# Altium schematic sheet Sheet_1.SchDoc: R2C2 - RepRapCncController
size A3; CompanyName: bitBOX; DrawnBy: FMendes75@gmail.com; Revision: V1.2P; SheetNumber: 1; SheetTotal: 3; PageSetup: Record=PageOptions|CenterHorizontal=True|CenterVertical=True|PrintScale=1.04|XCorrection=1.00|YCorrection=1.00|PrintKind=1|BorderSize=5000000|LeftOffset=0|BottomOffset=0|Orientation=2|PaperLength=1000|PaperWidth=1000|Scale=100|PaperSource=7|PrintQuality=-4|MediaType=1|DitherType=10|PaperKind=A3|PrintScaleMode=1; license: Creative Commons BY-NC-SA; Site: www.3dprinting-r2c2.com; ProjectName: R2C2 - RepRapCncController
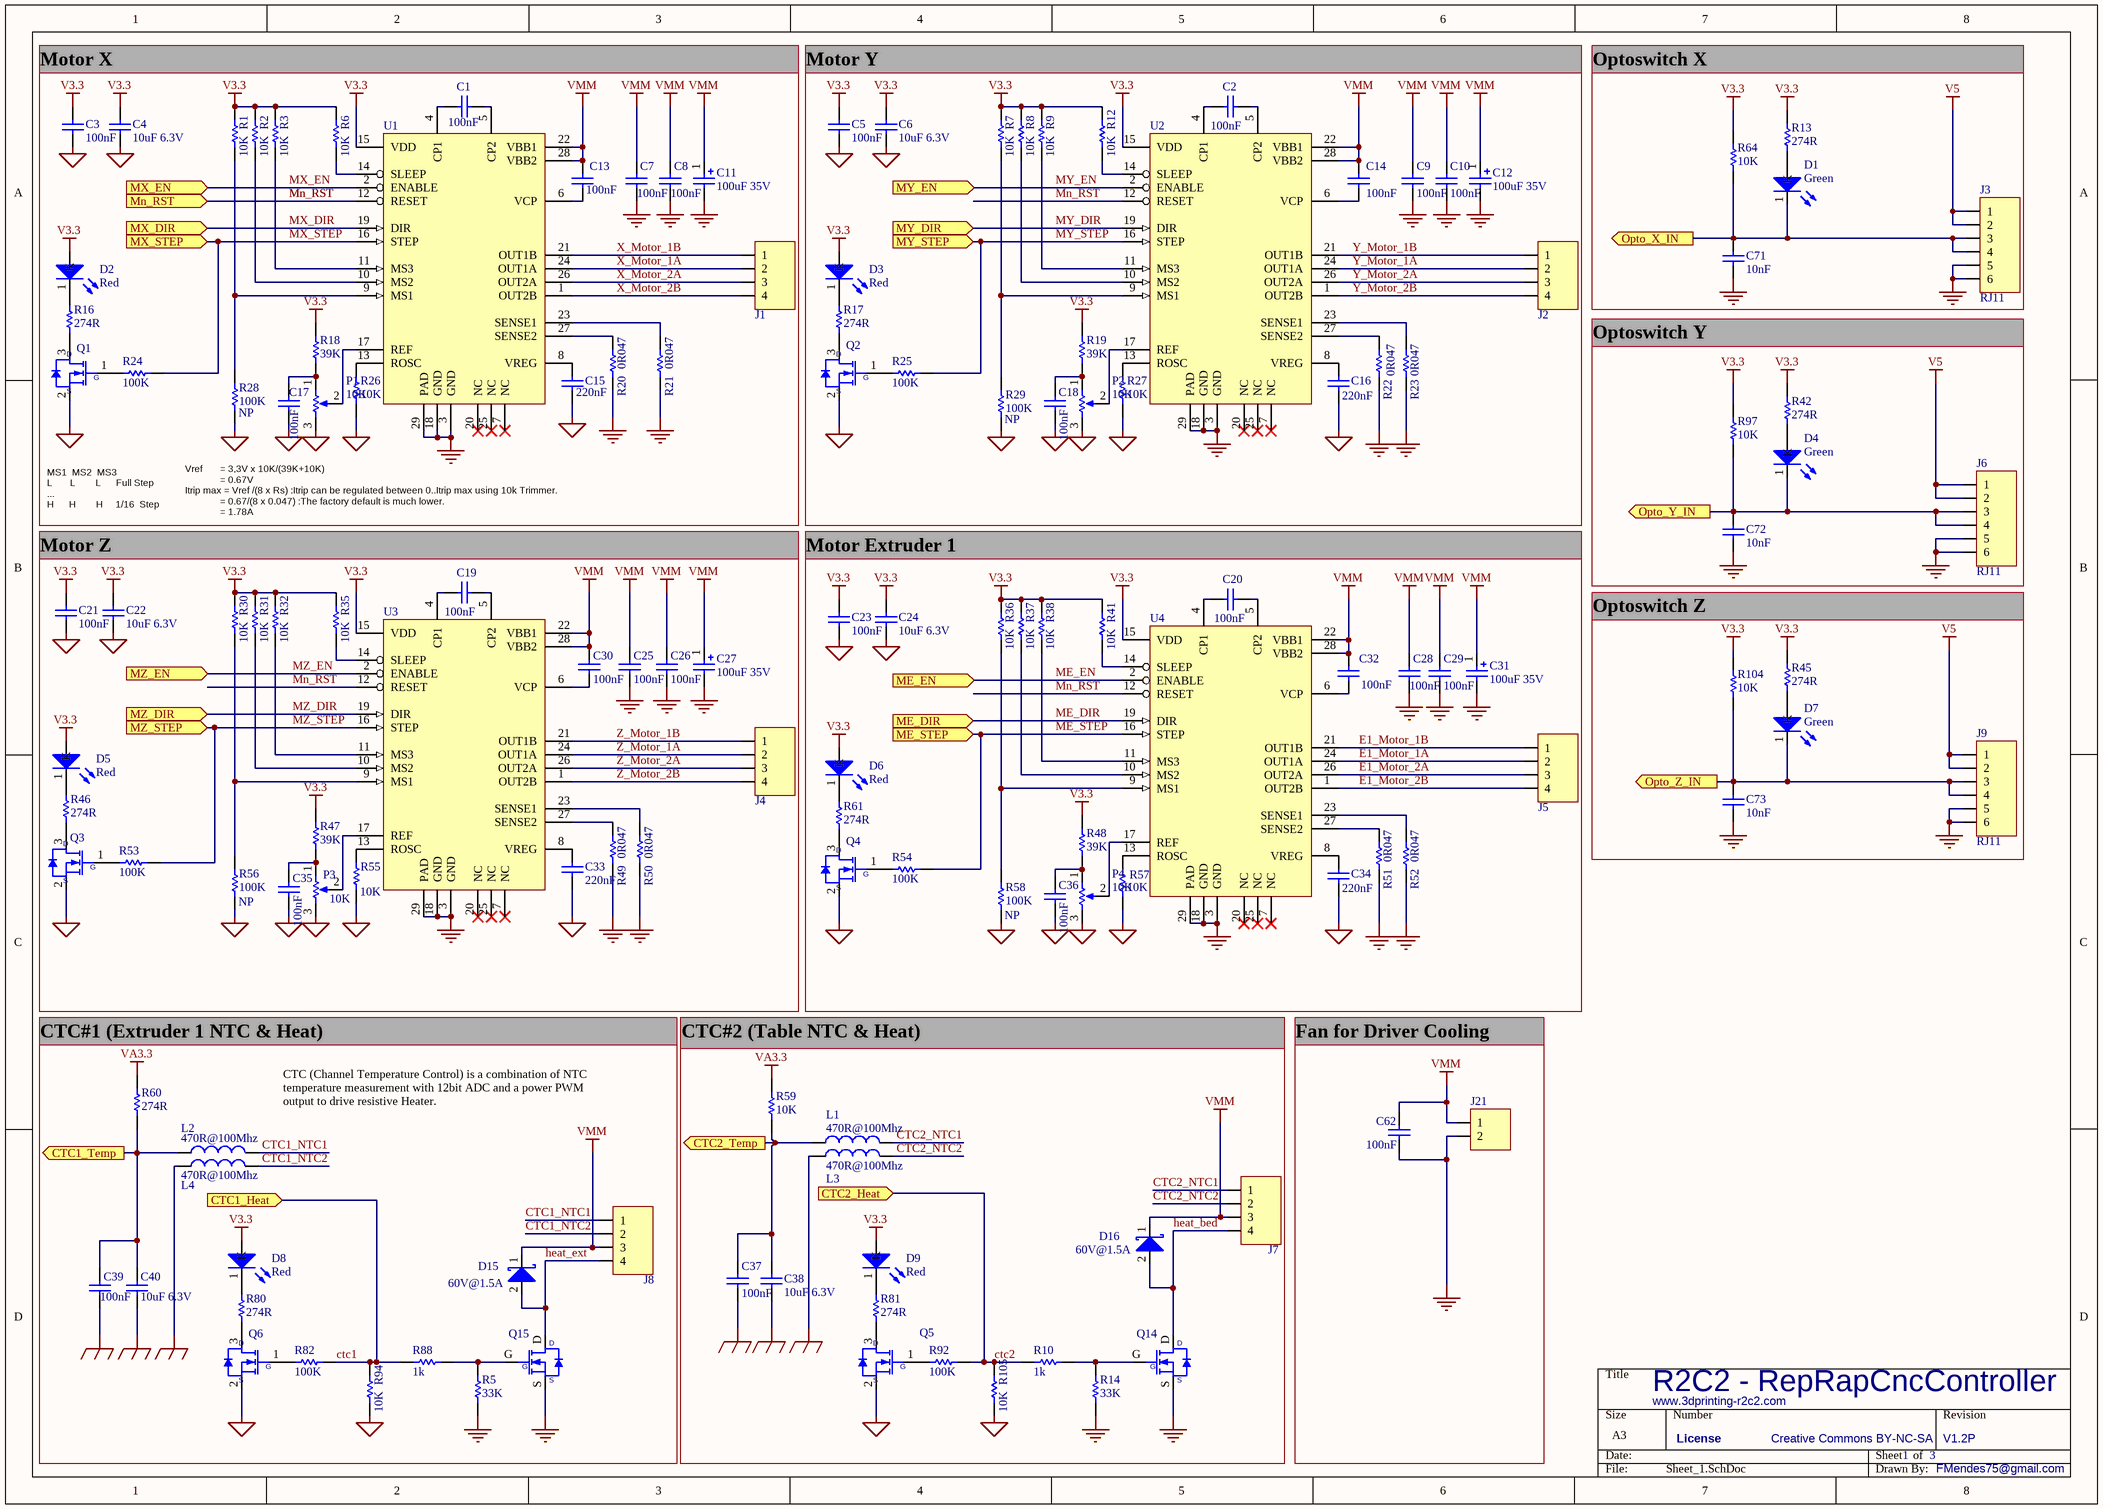
[diagram p0: Sheet_1.SchDoc]

## Parts
C1  100nF  [CAPC1608M]
C2  100nF  [CAPC1608M]
C3  100nF  [CAPC1608M]
C4  10uF 6.3V  [CAPC2012M]
C5  100nF  [CAPC1608M]
C6  10uF 6.3V  [CAPC2012M]
C7  100nF  [CAPC1608M]
C8  100nF  [CAPC1608M]
C9  100nF  [CAPC1608M]
C10  100nF  [CAPC1608M]
C11  100uF 35V  [CAPAE63x63MM]
C12  100uF 35V  [CAPAE63x63MM]
C13  100nF  [CAPC1608M]
C14  100nF  [CAPC1608M]
C15  220nF  [CAPC1608M]
C16  220nF  [CAPC1608M]
C17  100nF  [CAPC1608M]
C18  100nF  [CAPC1608M]
C19  100nF  [CAPC1608M]
C20  100nF  [CAPC1608M]
C21  100nF  [CAPC1608M]
C22  10uF 6.3V  [CAPC2012M]
C23  100nF  [CAPC1608M]
C24  10uF 6.3V  [CAPC2012M]
C25  100nF  [CAPC1608M]
C26  100nF  [CAPC1608M]
C27  100uF 35V  [CAPAE63x63MM]
C28  100nF  [CAPC1608M]
C29  100nF  [CAPC1608M]
C30  100nF  [CAPC1608M]
C31  100uF 35V  [CAPAE63x63MM]
C32  100nF  [CAPC1608M]
C33  220nF  [CAPC1608M]
C34  220nF  [CAPC1608M]
C35  100nF  [CAPC1608M]
C36  100nF  [CAPC1608M]
C37  100nF  [CAPC1608M]
C38  10uF 6.3V  [CAPC2012M]
C39  100nF  [CAPC1608M]
C40  10uF 6.3V  [CAPC2012M]
C62  100nF  [CAPC1608M]
C71  10nF  [CAPC1608M]
C72  10nF  [CAPC1608M]
C73  10nF  [CAPC1608M]
D1  Green  [LEDM_3216X12M]
D2  Red  [LEDM_3216X12M]
D3  Red  [LEDM_3216X12M]
D4  Green  [LEDM_3216X12M]
D5  Red  [LEDM_3216X12M]
D6  Red  [LEDM_3216X12M]
D7  Green  [LEDM_3216X12M]
D8  Red  [LEDM_3216X12M]
D9  Red  [LEDM_3216X12M]
D15  60V@1.5A  [SMA]
D16  60V@1.5A  [SMA]
J1  (no value)  [TE_SCREW_1X4]
J2  (no value)  [TE_SCREW_1X4]
J3  RJ11  [MOLEX_95022-2667]
J4  (no value)  [TE_SCREW_1X4]
J5  (no value)  [TE_SCREW_1X4]
J6  RJ11  [MOLEX_95022-2667]
J7  (no value)  [TE_SCREW_282841-4]
J8  (no value)  [TE_SCREW_282841-4]
J9  RJ11  [MOLEX_95022-2667]
J21  -  [MOLEX_22-29-2021]  (value not drawn)
L1  470R@100Mhz  [INDC1608M]
L2  470R@100Mhz  [INDC1608M]
L3  470R@100Mhz  [INDC1608M]
L4  470R@100Mhz  [INDC1608M]
P1  10K  [Trimmer_14]
P2  10K  [Trimmer_14]
P3  10K  [Trimmer_14]
P4  10K  [Trimmer_14]
Q1  (no value)  [SOT323-3AM]
Q2  (no value)  [SOT323-3AM]
Q3  (no value)  [SOT323-3AM]
Q4  (no value)  [SOT323-3AM]
Q5  (no value)  [SOT323-3AM]
Q6  (no value)  [SOT323-3AM]
Q14  (no value)  [SuperSOP8_csd17301]
Q15  (no value)  [SuperSOP8_csd17301]
R1  10K  [RESC1608M]
R2  10K  [RESC1608M]
R3  10K  [RESC1608M]
R5  33K  [RESC1608M]
R6  10K  [RESC1608M]
R7  10K  [RESC1608M]
R8  10K  [RESC1608M]
R9  10K  [RESC1608M]
R10  1k  [RESC1608M]
R12  10K  [RESC1608M]
R13  274R  [RESC1608M]
R14  33K  [RESC1608M]
R16  274R  [RESC1608M]
R17  274R  [RESC1608M]
R18  39K  [RESC1608M]
R19  39K  [RESC1608M]
R20  0R047  [RESC3216M]
R21  0R047  [RESC3216M]
R22  0R047  [RESC3216M]
R23  0R047  [RESC3216M]
R24  100K  [RESC1608M]
R25  100K  [RESC1608M]
R26  10K  [RESC1608M]
R27  10K  [RESC1608M]
R28  100K  Populate: NP  [RESC1608M]
R29  100K  Populate: NP  [RESC1608M]
R30  10K  [RESC1608M]
R31  10K  [RESC1608M]
R32  10K  [RESC1608M]
R35  10K  [RESC1608M]
R36  10K  [RESC1608M]
R37  10K  [RESC1608M]
R38  10K  [RESC1608M]
R41  10K  [RESC1608M]
R42  274R  [RESC1608M]
R45  274R  [RESC1608M]
R46  274R  [RESC1608M]
R47  39K  [RESC1608M]
R48  39K  [RESC1608M]
R49  0R047  [RESC3216M]
R50  0R047  [RESC3216M]
R51  0R047  [RESC3216M]
R52  0R047  [RESC3216M]
R53  100K  [RESC1608M]
R54  100K  [RESC1608M]
R55  10K  [RESC1608M]
R56  100K  Populate: NP  [RESC1608M]
R57  10K  [RESC1608M]
R58  100K  Populate: NP  [RESC1608M]
R59  10K  [RESC1608M]
R60  274R  [RESC1608M]
R61  274R  [RESC1608M]
R64  10K  [RESC1608M]
R80  274R  [RESC1608M]
R81  274R  [RESC1608M]
R82  100K  [RESC1608M]
R88  1k  [RESC1608M]
R92  100K  [RESC1608M]
R94  10K  [RESC1608M]
R97  10K  [RESC1608M]
R104  10K  [RESC1608M]
R105  10K  [RESC1608M]
U1  (no value)  [QFN50P500X500X100-28M]
U2  (no value)  [QFN50P500X500X100-28M]
U3  (no value)  [QFN50P500X500X100-28M]
U4  (no value)  [QFN50P500X500X100-28M]

## Ports
CTC1_Heat (in), CTC1_Temp (out), CTC2_Heat (in), CTC2_Temp (out), ME_DIR (in), ME_EN (in), ME_STEP (in), Mn_RST (in), MX_DIR (in), MX_EN (in), MX_STEP (in), MY_DIR (in), MY_EN (in), MY_STEP (in), MZ_DIR (in), MZ_EN (in), MZ_STEP (in), Opto_X_IN (out), Opto_Y_IN (out), Opto_Z_IN (out)

## Nets
GND: C3.1 C4.1 C5.1 C6.1 C15.1 C16.1 C17.1 C18.2 C21.1 C22.1 C23.1 C24.1 C33.1 C34.1 C35.1 C36.1 P1.3(TOP) P2.3(TOP) P3.3(TOP) P4.3(TOP) Q1.2(S) Q2.2(S) Q3.2(S) Q4.2(S) Q5.2(S) Q6.2(S) R26.1 R27.1 R28.1 R29.1 R55.1 R56.1 R57.1 R58.1 R94.1 R105.1
GND_A: C37.1 C38.1 C39.1 C40.1 L3.1 L4.1
Star_GND: C7.2 C8.1 C9.1 C10.1 C11.2 C12.2 C25.1 C26.1 C27.2 C28.1 C29.1 C31.2 C62.1 C71.2 C72.2 C73.2 J3.5 J3.6 J6.5 J6.6 J9.5 J9.6 J21.2 Q14.S Q15.S R5.1 R14.1 R20.1 R21.1 R22.1 R23.1 R49.1 R50.1 R51.1 R52.1 U1.3(GND) U1.18(GND) U1.29(PAD) U2.3(GND) U2.18(GND) U2.29(PAD) U3.3(GND) U3.18(GND) U3.29(PAD) U4.3(GND) U4.18(GND) U4.29(PAD)
V3.3: C3.2 C4.2 C5.2 C6.2 C21.2 C22.2 C23.2 C24.2 D2.2(A) D3.2(A) D5.2(A) D6.2(A) D8.2(A) D9.2(A) R1.2 R2.2 R3.2 R6.2 R7.2 R8.2 R9.2 R12.2 R13.2 R18.2 R19.2 R30.2 R31.2 R32.2 R35.2 R36.2 R37.2 R38.2 R41.2 R42.2 R45.2 R47.2 R48.2 R64.2 R97.2 R104.2 U1.15(VDD) U2.15(VDD) U3.15(VDD) U4.15(VDD)
V5: J3.1 J3.2 J6.1 J6.2 J9.1 J9.2
VA3.3: R59.2 R60.2
VMM: C7.1 C8.2 C9.2 C10.2 C11.1 C12.1 C13.2 C14.2 C25.2 C26.2 C27.1 C28.2 C29.2 C30.2 C31.1 C32.2 C62.2 D15.1(K) D16.1(K) J7.3 J8.3 J21.1 U1.22(VBB1) U1.28(VBB2) U2.22(VBB1) U2.28(VBB2) U3.22(VBB1) U3.28(VBB2) U4.22(VBB1) U4.28(VBB2)
ctc1: R82.2 R88.1 R94.2 ; port CTC1_Heat
CTC1_NTC1: J8.1 L2.2
CTC1_NTC2: J8.2 L4.2
CTC1_Temp: C39.2 C40.2 L2.1 R60.1 ; port CTC1_Temp
ctc2: R10.1 R92.2 R105.2 ; port CTC2_Heat
CTC2_NTC1: J7.1 L1.2
CTC2_NTC2: J7.2 L3.2
CTC2_Temp: C37.2 C38.2 L1.1 R59.1 ; port CTC2_Temp
E1_Motor_1A: J5.2 U4.24(OUT1A)
E1_Motor_1B: J5.1 U4.21(OUT1B)
E1_Motor_2A: J5.3 U4.26(OUT2A)
E1_Motor_2B: J5.4 U4.1(OUT2B)
heat_bed: D16.2(A) J7.4 Q14.D
heat_ext: D15.2(A) J8.4 Q15.D
ME_DIR: U4.19(DIR) ; port ME_DIR
ME_EN: U4.2(ENABLE) ; port ME_EN
ME_STEP: R54.2 U4.16(STEP) ; port ME_STEP
Mn_RST: U1.12(RESET) U2.12(RESET) U3.12(RESET) U4.12(RESET) ; port Mn_RST
MX_DIR: U1.19(DIR) ; port MX_DIR
MX_EN: U1.2(ENABLE) ; port MX_EN
MX_STEP: R24.2 U1.16(STEP) ; port MX_STEP
MY_DIR: U2.19(DIR) ; port MY_DIR
MY_EN: U2.2(ENABLE) ; port MY_EN
MY_STEP: R25.2 U2.16(STEP) ; port MY_STEP
MZ_DIR: U3.19(DIR) ; port MZ_DIR
MZ_EN: U3.2(ENABLE) ; port MZ_EN
MZ_STEP: R53.2 U3.16(STEP) ; port MZ_STEP
Opto_X_IN: C71.1 D1.1(K) J3.3 J3.4 R64.1 ; port Opto_X_IN
Opto_Y_IN: C72.1 D4.1(K) J6.3 J6.4 R97.1 ; port Opto_Y_IN
Opto_Z_IN: C73.1 D7.1(K) J9.3 J9.4 R104.1 ; port Opto_Z_IN
X_Motor_1A: J1.2 U1.24(OUT1A)
X_Motor_1B: J1.1 U1.21(OUT1B)
X_Motor_2A: J1.3 U1.26(OUT2A)
X_Motor_2B: J1.4 U1.1(OUT2B)
Y_Motor_1A: J2.2 U2.24(OUT1A)
Y_Motor_1B: J2.1 U2.21(OUT1B)
Y_Motor_2A: J2.3 U2.26(OUT2A)
Y_Motor_2B: J2.4 U2.1(OUT2B)
Z_Motor_1A: J4.2 U3.24(OUT1A)
Z_Motor_1B: J4.1 U3.21(OUT1B)
Z_Motor_2A: J4.3 U3.26(OUT2A)
Z_Motor_2B: J4.4 U3.1(OUT2B)
NetC1_1: C1.1 U1.5(CP2)
NetC1_2: C1.2 U1.4(CP1)
NetC2_1: C2.1 U2.4(CP1)
NetC2_2: C2.2 U2.5(CP2)
NetC13_1: C13.1 U1.6(VCP)
NetC14_1: C14.1 U2.6(VCP)
NetC15_2: C15.2 U1.8(VREG)
NetC16_2: C16.2 U2.8(VREG)
NetC17_2: C17.2 P1.1(BOT) R18.1
NetC18_1: C18.1 P2.1(BOT) R19.1
NetC19_1: C19.1 U3.5(CP2)
NetC19_2: C19.2 U3.4(CP1)
NetC20_1: C20.1 U4.4(CP1)
NetC20_2: C20.2 U4.5(CP2)
NetC30_1: C30.1 U3.6(VCP)
NetC32_1: C32.1 U4.6(VCP)
NetC33_2: C33.2 U3.8(VREG)
NetC34_2: C34.2 U4.8(VREG)
NetC35_2: C35.2 P3.1(BOT) R47.1
NetC36_2: C36.2 P4.1(BOT) R48.1
NetD1_2: D1.2(A) R13.1
NetD2_1: D2.1(K) R16.2
NetD3_1: D3.1(K) R17.2
NetD4_2: D4.2(A) R42.1
NetD5_1: D5.1(K) R46.2
NetD6_1: D6.1(K) R61.2
NetD7_2: D7.2(A) R45.1
NetD8_1: D8.1(K) R80.2
NetD9_1: D9.1(K) R81.2
NetP1_2: P1.2(TAP) U1.17(REF)
NetP2_2: P2.2(TAP) U2.17(REF)
NetP3_2: P3.2(TAP) U3.17(REF)
NetP4_2: P4.2(TAP) U4.17(REF)
NetQ1_1: Q1.1(G) R24.1
NetQ1_3: Q1.3(D) R16.1
NetQ2_1: Q2.1(G) R25.1
NetQ2_3: Q2.3(D) R17.1
NetQ3_1: Q3.1(G) R53.1
NetQ3_3: Q3.3(D) R46.1
NetQ4_1: Q4.1(G) R54.1
NetQ4_3: Q4.3(D) R61.1
NetQ5_1: Q5.1(G) R92.1
NetQ5_3: Q5.3(D) R81.1
NetQ6_1: Q6.1(G) R82.1
NetQ6_3: Q6.3(D) R80.1
NetQ14_G: Q14.G R10.2 R14.2
NetQ15_G: Q15.G R5.2 R88.2
NetR1_1: R1.1 R28.2 U1.9(MS1)
NetR2_1: R2.1 U1.10(MS2)
NetR3_1: R3.1 U1.11(MS3)
NetR6_1: R6.1 U1.14(SLEEP)
NetR7_1: R7.1 R29.2 U2.9(MS1)
NetR8_1: R8.1 U2.10(MS2)
NetR9_1: R9.1 U2.11(MS3)
NetR12_1: R12.1 U2.14(SLEEP)
NetR20_2: R20.2 U1.27(SENSE2)
NetR21_2: R21.2 U1.23(SENSE1)
NetR22_2: R22.2 U2.27(SENSE2)
NetR23_2: R23.2 U2.23(SENSE1)
NetR26_2: R26.2 U1.13(ROSC)
NetR27_2: R27.2 U2.13(ROSC)
NetR30_1: R30.1 R56.2 U3.9(MS1)
NetR31_1: R31.1 U3.10(MS2)
NetR32_1: R32.1 U3.11(MS3)
NetR35_1: R35.1 U3.14(SLEEP)
NetR36_1: R36.1 R58.2 U4.9(MS1)
NetR37_1: R37.1 U4.10(MS2)
NetR38_1: R38.1 U4.11(MS3)
NetR41_1: R41.1 U4.14(SLEEP)
NetR49_2: R49.2 U3.27(SENSE2)
NetR50_2: R50.2 U3.23(SENSE1)
NetR51_2: R51.2 U4.27(SENSE2)
NetR52_2: R52.2 U4.23(SENSE1)
NetR55_2: R55.2 U3.13(ROSC)
NetR57_2: R57.2 U4.13(ROSC)

Not connected (* = marked no-connect by the designer): U1 7(NC)* 20(NC)* 25(NC)*; U2 7(NC)* 20(NC)* 25(NC)*; U3 7(NC)* 20(NC)* 25(NC)*; U4 7(NC)* 20(NC)* 25(NC)*

## Notes on the sheet
- Motor X
- Motor Y
- Optoswitch X
- Optoswitch Y
- MS1  MS2  MS3
  L       L        L      Full Step
  ...
  H      H        H     1/16  Step
- Vref       = 3,3V x 10K/(39K+10K)
  = 0.67V
  Itrip max = Vref /(8 x Rs)	:Itrip can be regulated between 0..Itrip max using 10k Trimmer.
  = 0.67/(8 x 0.047)	:The factory default is much lower.
  = 1.78A
- Motor Z
- Motor Extruder 1
- Optoswitch Z
- (near R60) CTC#1 (Extruder 1 NTC & Heat)
- (near R59) CTC#2 (Table NTC & Heat)
- Fan for Driver Cooling
- CTC (Channel Temperature Control) is a combination of NTC
  temperature measurement with 12bit ADC and a power PWM
  output to drive resistive Heater.
- License

## Library data of the parts
C1-C3 C5 C7-C10 C13 C14 C17-C21 C23 C25 C26 C28-C30 C32 C35-C37 C39 C62 = 10000054: CAP CER 0.1UF 50V Y5V 0603; Manufacturer: Yageo; Man PN: CC0603ZRY5V9BB104; Pack: 0603; Value: 100nF; Component Type: Standard; Digi-Key: 311-1343-1-ND
C4 C6 C22 C24 C38 C40 = 10000001: CAP CER 10UF 10V Y5V 0805; Manufacturer: Yageo; Man PN: CC0805ZKY5V6BB106; Pack: 0805; Value: 10uF 6.3V; Component Type: Standard; Digi-Key: 311-1355-1-ND
C11 C12 C27 C31 = 10000069: CAP ALUM 100UF 35V 20% SMD; Manufacturer: Panasonic; Man PN: EEE-HA1V101XP; Component Type: Standard; Value: 100uF 35V; Digi-Key: PCE4238CT-ND
C15 C16 C33 C34 = 10000059: CAP CER 0.22UF 16V 10% X7R 0603; Manufacturer: TDK; Pack: 0603; Man PN: C1608X7R1C224K080AC; Value: 220nF; Component Type: Standard; Digi-Key: 445-1318-1-ND
C71-C73 = 10000057: CAP CER 10000PF 50V 10% X7R 0603; Manufacturer: TDK; Pack: 0603; Man PN: C1608X7R1H103K080AA; Component Type: Standard; Value: 10nF; Digi-Key: 445-1311-1-ND
D1 D4 D7 = 10000008: LED CHIPLED 570NM GREEN 1206 SMD; Manufacturer: OSRAM; Man PN: LG N971-KN-1; Pack: 1206; Value: Green; Component Type: Standard; Digi-Key: 475-1407-1-ND
D2 D3 D5 D6 D8 D9 = 10000089: LED CHIPLED 645NM RED DIFF 1206; Manufacturer: OSRAM; Man PN: LH N974-KN-1; Pack: 1206; Value: Red; Digi-Key: 475-1416-1-ND; Signal Integrity: -; Simulation: -; Component Type: Standard
D15 D16 = 10000010: DIODE SCHOTTKY 60V 2.1A DO214AC; Manufacturer: VISHAY; Man PN: VS-10MQ060NTRPBF; Component Type: Standard; Value: 60V@1.5A; Pack: SMA; Digi-Key: 10MQ060NPBFCT-ND
J1 J2 J7 J8 = 10000023: Con 4; Manufacturer: TE; Man PN: 282841-4; Component Type: Standard
  J1 J2: Digi-Key: A98335-ND
  J7 J8: Digi-Key: A98081-ND
J3 J6 J9 = 10000062: CONN MOD JACK R/A 6P4C; Manufacturer: Stewart Connector; Man PN: SS-6446-NF; Value: RJ11; Digi-Key: 380-1018-ND; Component Type: Standard
J4 J5 = 10000023: Con 4; Manufacturer: TE; Man PN: 282834-4; Digi-Key: A98335-ND; Component Type: Standard
J21 = 10000097: CONN HEADER 2POS .100 VERT GOLD; Manufacturer: Molex; Component Type: Standard; Man PN: 22-29-2021; Value: -; Pack: -; Digi-Key: WM2744-ND
L1-L4 = 10000032: FERRITE CHIP 470 OHM 1000MA 0603; Manufacturer: MURATA; Man PN: BLM18PG471SN1D; Pack: 0603; Value: 470R@100Mhz; Component Type: Standard; Digi-Key: 490-5223-1-ND
P1-P4 = 10000092: TRIMMER 10K OHM 0.5W TH; Manufacturer: copal; Man PN: CT6EP103; Component Type: Standard; Value: 10K; Pack: -; Digi-Key: CT6EP103-ND
Q1-Q6 = 10000039: MOSFET N-CH SGL 60V SOT-323; Manufacturer: NXP; Man PN: 2N7002PW; Pack: SOT323; Component Type: Standard; Digi-Key: 568-5987-1-ND
Q14 Q15 = 10000039: MOSFET N-CH 30V 28A 8SON; Manufacturer: Texas Instruments; Man PN: CSD17301Q5A; Pack: SOT323; Component Type: Standard; Digi-Key: 296-25795-1-ND
R1-R3 R6-R9 R12 R26 R27 R30-R32 R35-R38 R41 R55 R57 R59 R64 R94 R97 R104 R105 = 10000044: RES 10K OHM 1/10W 5% 0603 SMD; Manufacturer: Yageo; Man PN: RC0603JR-0710KL; Pack: 0603; Value: 10K; Component Type: Standard; Digi-Key: 311-10KGRCT-ND
R5 R14 = 10000044: RES 33K OHM 1/10W 1% 0603; Manufacturer: Stackpole Electronics Inc; Man PN: RMCF0603FT33K0; Pack: 0603; Value: 33K; Component Type: Standard; Digi-Key: RMCF0603FT33K0CT-ND
R10 R88 = 10000042: RES 1K OHM 1/10W 5% 0603; Manufacturer: Stackpole Electronics Inc; Man PN: RMCF0603JT1K00; Pack: 0603; Value: 1k; Component Type: Standard; Digi-Key: RMCF0603JT1K00CT-ND
R13 R16 R17 R42 R45 R46 R60 R61 R80 R81 = 10000041: RES 274 OHM 1/10W 1% 0603; Manufacturer: Stackpole Electronics Inc; Man PN: RMCF0603FT274R; Pack: 0603; Value: 274R; Component Type: Standard; Digi-Key: RMCF0603FT274RCT-ND
R18 R19 R47 R48 = 10000087: RES 39K OHM 1/10W 1% 0603; Manufacturer: Stackpole Electronics Inc; Man PN: RMCF0603FT39K0; Pack: 0603; Value: 39K; Component Type: Standard; Digi-Key: RMCF0603FT39K0CT-ND
R20-R23 R49-R52 = 10000047: RES .047 OHM 1/2W 1% 1206 SMD; Manufacturer: Ohmite; Man PN: LVK12R047FER; Pack: 1206; Value: 0R047; Component Type: Standard; Digi-Key: LVK12R047FERCT-ND
R24 R25 R28 R29 R53 R54 R56 R58 R82 R92 = 10000045: RES 100K OHM 1/10W 5% 0603 SMD; Manufacturer: Yageo; Man PN: RC0603JR-07100KL; Pack: 0603; Value: 100K; Component Type: Standard; Digi-Key: 311-100KGRCT-ND
U1 = 10000094: IC MOTOR DRIVER PAR 28QFN; Manufacturer: Allegro MicroSystems, LLC; Man PN: A4988SETTR-T; Pack: QFN28; Value: A4988SETTR-T; Component Type: Standard; Digi-Key: 620-1343-1-ND
U2-U4 = 10000094: IC MOTOR DRIVER PAR 28QFN; Manufacturer: Allegro MicroSystems, LLC; Man PN: A4988SETTR-T; Value: A4988SETTR-T; Pack: QFN28; Component Type: Standard; Digi-Key: 620-1343-1-ND